# Altium schematic sheet fpga32-serdes-power.SchDoc
size Tabloid; SheetNumber: 55; SheetTotal: 71
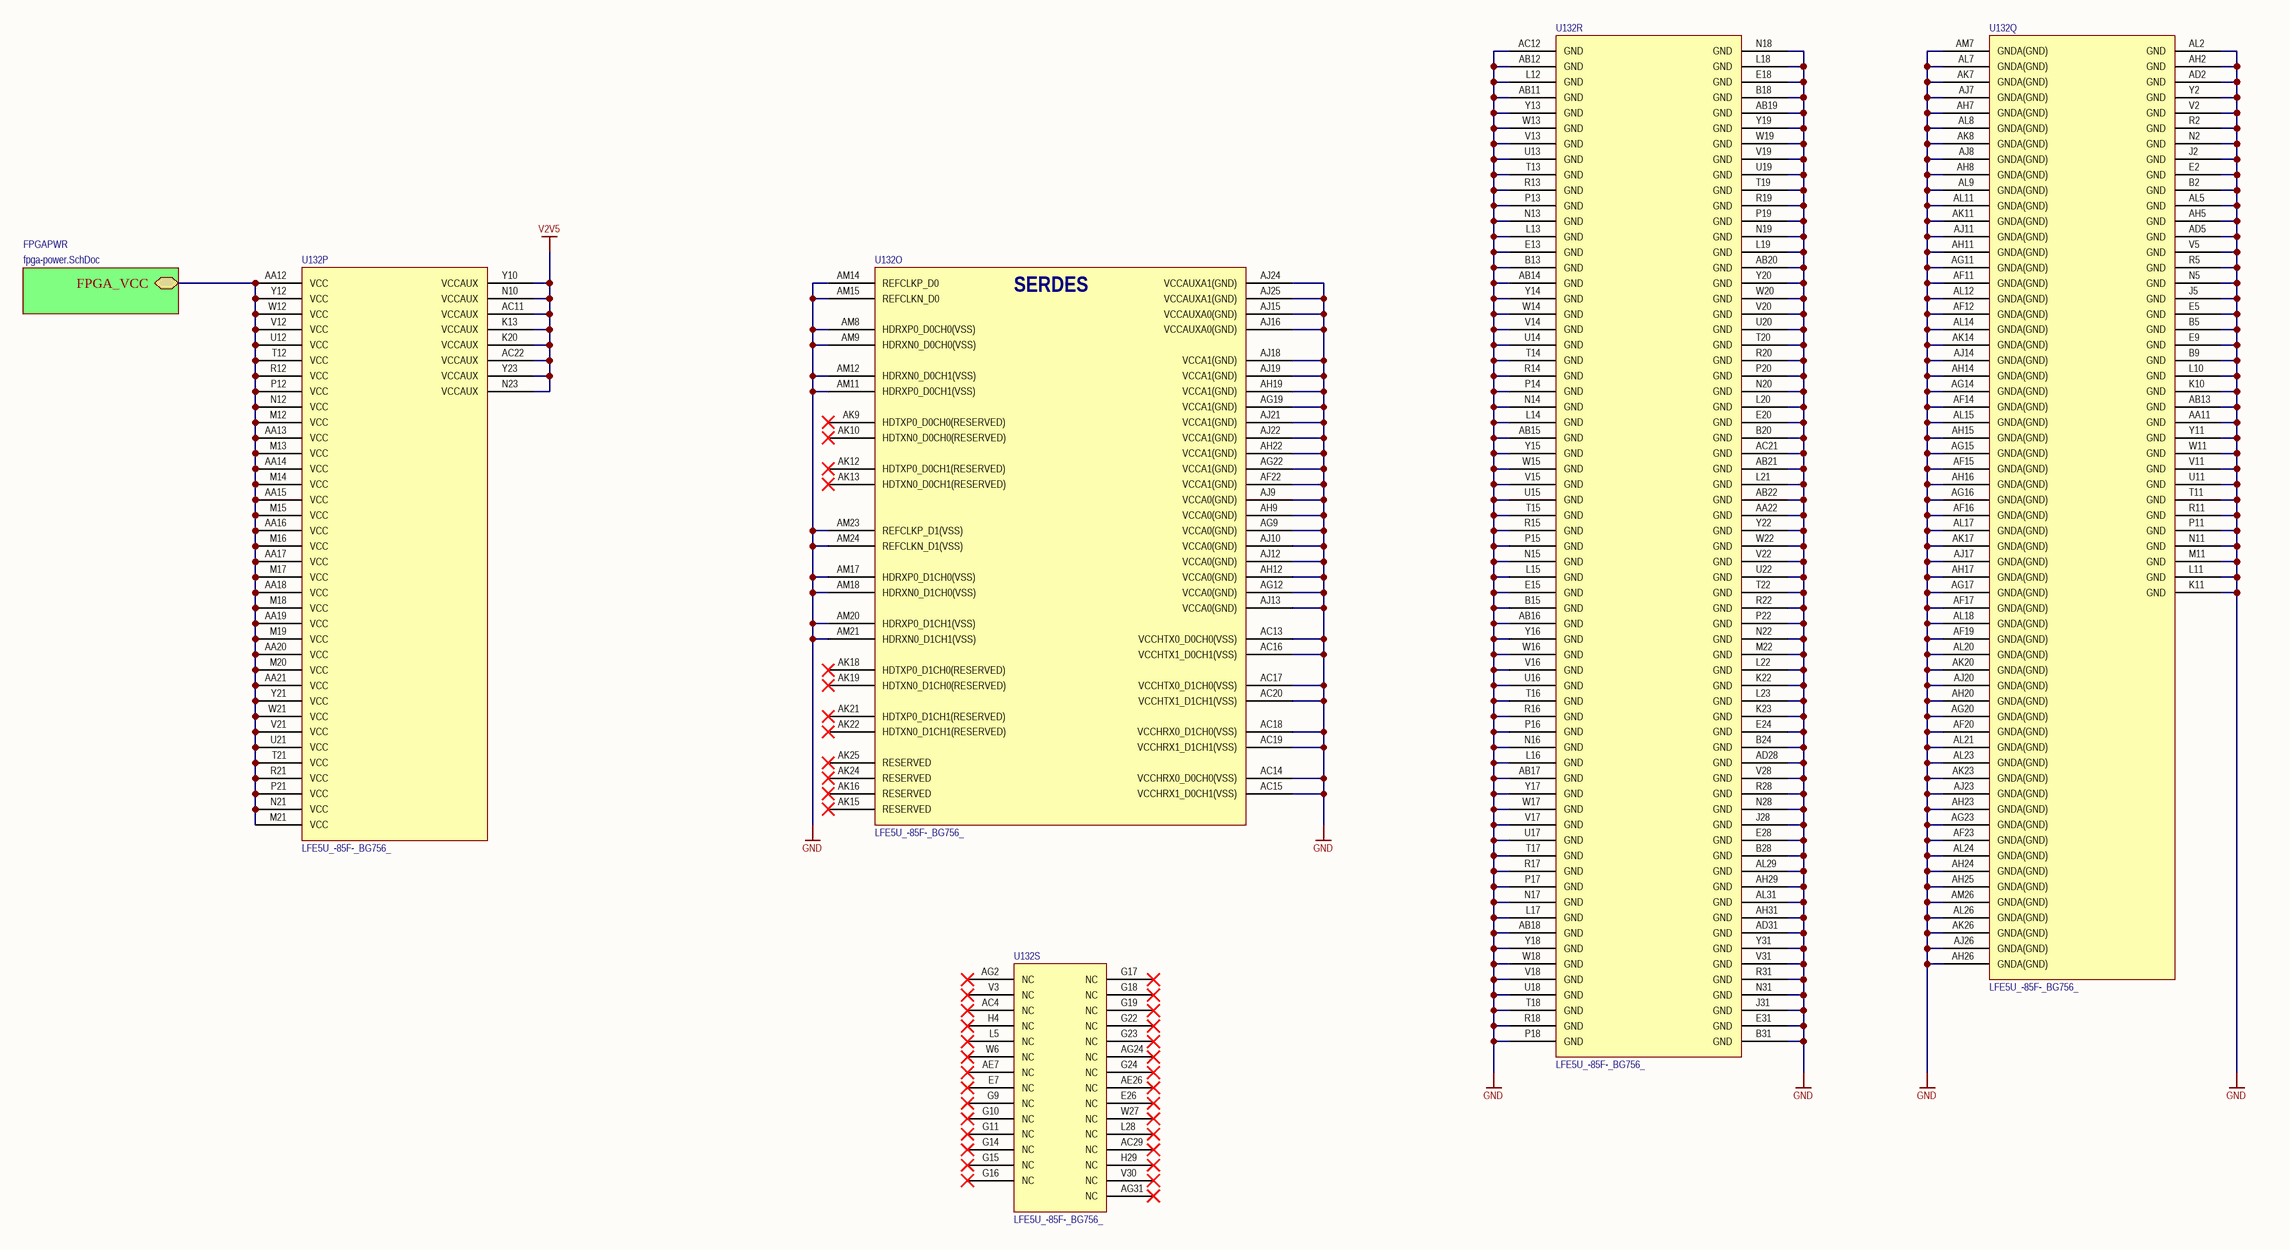
[diagram p0: fpga32-serdes-power.SchDoc]

## Parts
U132  LFE5U_-85F-_BG756_  [caBGA756]  (parts O,P,Q,R,S of 19)

## Sub-sheets
FPGAPWR = fpga-power.SchDoc: FPGA_VCC

## Nets
GND: U132.AA11(GND) U132.AA22(GND) U132.AB11(GND) U132.AB12(GND) U132.AB13(GND) U132.AB14(GND) U132.AB15(GND) U132.AB16(GND) U132.AB17(GND) U132.AB18(GND) U132.AB19(GND) U132.AB20(GND) U132.AB21(GND) U132.AB22(GND) U132.AC12(GND) U132.AC13(VCCHTX0_D0CH0(VSS)) U132.AC14(VCCHRX0_D0CH0(VSS)) U132.AC15(VCCHRX1_D0CH1(VSS)) U132.AC16(VCCHTX1_D0CH1(VSS)) U132.AC17(VCCHTX0_D1CH0(VSS)) U132.AC18(VCCHRX0_D1CH0(VSS)) U132.AC19(VCCHRX1_D1CH1(VSS)) U132.AC20(VCCHTX1_D1CH1(VSS)) U132.AC21(GND) U132.AD2(GND) U132.AD5(GND) U132.AD28(GND) U132.AD31(GND) U132.AF11(GNDA(GND)) U132.AF12(GNDA(GND)) U132.AF14(GNDA(GND)) U132.AF15(GNDA(GND)) U132.AF16(GNDA(GND)) U132.AF17(GNDA(GND)) U132.AF19(GNDA(GND)) U132.AF20(GNDA(GND)) U132.AF22(VCCA1(GND)) U132.AF23(GNDA(GND)) U132.AG9(VCCA0(GND)) U132.AG11(GNDA(GND)) U132.AG12(VCCA0(GND)) U132.AG14(GNDA(GND)) U132.AG15(GNDA(GND)) U132.AG16(GNDA(GND)) U132.AG17(GNDA(GND)) U132.AG19(VCCA1(GND)) U132.AG20(GNDA(GND)) U132.AG22(VCCA1(GND)) U132.AG23(GNDA(GND)) U132.AH2(GND) U132.AH5(GND) U132.AH7(GNDA(GND)) U132.AH8(GNDA(GND)) U132.AH9(VCCA0(GND)) U132.AH11(GNDA(GND)) U132.AH12(VCCA0(GND)) U132.AH14(GNDA(GND)) U132.AH15(GNDA(GND)) U132.AH16(GNDA(GND)) U132.AH17(GNDA(GND)) U132.AH19(VCCA1(GND)) U132.AH20(GNDA(GND)) U132.AH22(VCCA1(GND)) U132.AH23(GNDA(GND)) U132.AH24(GNDA(GND)) U132.AH25(GNDA(GND)) U132.AH26(GNDA(GND)) U132.AH29(GND) U132.AH31(GND) U132.AJ7(GNDA(GND)) U132.AJ8(GNDA(GND)) U132.AJ9(VCCA0(GND)) U132.AJ10(VCCA0(GND)) U132.AJ11(GNDA(GND)) U132.AJ12(VCCA0(GND)) U132.AJ13(VCCA0(GND)) U132.AJ14(GNDA(GND)) U132.AJ15(VCCAUXA0(GND)) U132.AJ16(VCCAUXA0(GND)) U132.AJ17(GNDA(GND)) U132.AJ18(VCCA1(GND)) U132.AJ19(VCCA1(GND)) U132.AJ20(GNDA(GND)) U132.AJ21(VCCA1(GND)) U132.AJ22(VCCA1(GND)) U132.AJ23(GNDA(GND)) U132.AJ24(VCCAUXA1(GND)) U132.AJ25(VCCAUXA1(GND)) U132.AJ26(GNDA(GND)) U132.AK7(GNDA(GND)) U132.AK8(GNDA(GND)) U132.AK11(GNDA(GND)) U132.AK14(GNDA(GND)) U132.AK17(GNDA(GND)) U132.AK20(GNDA(GND)) U132.AK23(GNDA(GND)) U132.AK26(GNDA(GND)) U132.AL2(GND) U132.AL5(GND) U132.AL7(GNDA(GND)) U132.AL8(GNDA(GND)) U132.AL9(GNDA(GND)) U132.AL11(GNDA(GND)) U132.AL12(GNDA(GND)) U132.AL14(GNDA(GND)) U132.AL15(GNDA(GND)) U132.AL17(GNDA(GND)) U132.AL18(GNDA(GND)) U132.AL20(GNDA(GND)) U132.AL21(GNDA(GND)) U132.AL23(GNDA(GND)) U132.AL24(GNDA(GND)) U132.AL26(GNDA(GND)) U132.AL29(GND) U132.AL31(GND) U132.AM7(GNDA(GND)) U132.AM8(HDRXP0_D0CH0(VSS)) U132.AM9(HDRXN0_D0CH0(VSS)) U132.AM11(HDRXP0_D0CH1(VSS)) U132.AM12(HDRXN0_D0CH1(VSS)) U132.AM14(REFCLKP_D0) U132.AM15(REFCLKN_D0) U132.AM17(HDRXP0_D1CH0(VSS)) U132.AM18(HDRXN0_D1CH0(VSS)) U132.AM20(HDRXP0_D1CH1(VSS)) U132.AM21(HDRXN0_D1CH1(VSS)) U132.AM23(REFCLKP_D1(VSS)) U132.AM24(REFCLKN_D1(VSS)) U132.AM26(GNDA(GND)) U132.B2(GND) U132.B5(GND) U132.B9(GND) U132.B13(GND) U132.B15(GND) U132.B18(GND) U132.B20(GND) U132.B24(GND) U132.B28(GND) U132.B31(GND) U132.E2(GND) U132.E5(GND) U132.E9(GND) U132.E13(GND) U132.E15(GND) U132.E18(GND) U132.E20(GND) U132.E24(GND) U132.E28(GND) U132.E31(GND) U132.J2(GND) U132.J5(GND) U132.J28(GND) U132.J31(GND) U132.K10(GND) U132.K11(GND) U132.K22(GND) U132.K23(GND) U132.L10(GND) U132.L11(GND) U132.L12(GND) U132.L13(GND) U132.L14(GND) U132.L15(GND) U132.L16(GND) U132.L17(GND) U132.L18(GND) U132.L19(GND) U132.L20(GND) U132.L21(GND) U132.L22(GND) U132.L23(GND) U132.M11(GND) U132.M22(GND) U132.N2(GND) U132.N5(GND) U132.N11(GND) U132.N13(GND) U132.N14(GND) U132.N15(GND) U132.N16(GND) U132.N17(GND) U132.N18(GND) U132.N19(GND) U132.N20(GND) U132.N22(GND) U132.N28(GND) U132.N31(GND) U132.P11(GND) U132.P13(GND) U132.P14(GND) U132.P15(GND) U132.P16(GND) U132.P17(GND) U132.P18(GND) U132.P19(GND) U132.P20(GND) U132.P22(GND) U132.R2(GND) U132.R5(GND) U132.R11(GND) U132.R13(GND) U132.R14(GND) U132.R15(GND) U132.R16(GND) U132.R17(GND) U132.R18(GND) U132.R19(GND) U132.R20(GND) U132.R22(GND) U132.R28(GND) U132.R31(GND) U132.T11(GND) U132.T13(GND) U132.T14(GND) U132.T15(GND) U132.T16(GND) U132.T17(GND) U132.T18(GND) U132.T19(GND) U132.T20(GND) U132.T22(GND) U132.U11(GND) U132.U13(GND) U132.U14(GND) U132.U15(GND) U132.U16(GND) U132.U17(GND) U132.U18(GND) U132.U19(GND) U132.U20(GND) U132.U22(GND) U132.V2(GND) U132.V5(GND) U132.V11(GND) U132.V13(GND) U132.V14(GND) U132.V15(GND) U132.V16(GND) U132.V17(GND) U132.V18(GND) U132.V19(GND) U132.V20(GND) U132.V22(GND) U132.V28(GND) U132.V31(GND) U132.W11(GND) U132.W13(GND) U132.W14(GND) U132.W15(GND) U132.W16(GND) U132.W17(GND) U132.W18(GND) U132.W19(GND) U132.W20(GND) U132.W22(GND) U132.Y2(GND) U132.Y11(GND) U132.Y13(GND) U132.Y14(GND) U132.Y15(GND) U132.Y16(GND) U132.Y17(GND) U132.Y18(GND) U132.Y19(GND) U132.Y20(GND) U132.Y22(GND) U132.Y31(GND)
V2V5: U132.AC11(VCCAUX) U132.AC22(VCCAUX) U132.K13(VCCAUX) U132.K20(VCCAUX) U132.N10(VCCAUX) U132.N23(VCCAUX) U132.Y10(VCCAUX) U132.Y23(VCCAUX)
NetU132_AA12: U132.AA12(VCC) U132.AA13(VCC) U132.AA14(VCC) U132.AA15(VCC) U132.AA16(VCC) U132.AA17(VCC) U132.AA18(VCC) U132.AA19(VCC) U132.AA20(VCC) U132.AA21(VCC) U132.M12(VCC) U132.M13(VCC) U132.M14(VCC) U132.M15(VCC) U132.M16(VCC) U132.M17(VCC) U132.M18(VCC) U132.M19(VCC) U132.M20(VCC) U132.M21(VCC) U132.N12(VCC) U132.N21(VCC) U132.P12(VCC) U132.P21(VCC) U132.R12(VCC) U132.R21(VCC) U132.T12(VCC) U132.T21(VCC) U132.U12(VCC) U132.U21(VCC) U132.V12(VCC) U132.V21(VCC) U132.W12(VCC) U132.W21(VCC) U132.Y12(VCC) U132.Y21(VCC) ; sheet FPGAPWR/FPGA_VCC

Not connected (* = marked no-connect by the designer): U132 AC4(NC)* AC29(NC)* AE7(NC)* AE26(NC)* AG2(NC)* AG24(NC)* AG31(NC)* AK9(HDTXP0_D0CH0(RESERVED))* AK10(HDTXN0_D0CH0(RESERVED))* AK12(HDTXP0_D0CH1(RESERVED))* AK13(HDTXN0_D0CH1(RESERVED))* AK15(RESERVED)* AK16(RESERVED)* AK18(HDTXP0_D1CH0(RESERVED))* AK19(HDTXN0_D1CH0(RESERVED))* AK21(HDTXP0_D1CH1(RESERVED))* AK22(HDTXN0_D1CH1(RESERVED))* AK24(RESERVED)* AK25(RESERVED)* E7(NC)* E26(NC)* G9(NC)* G10(NC)* G11(NC)* G14(NC)* G15(NC)* G16(NC)* G17(NC)* G18(NC)* G19(NC)* G22(NC)* G23(NC)* G24(NC)* H4(NC)* H29(NC)* L5(NC)* L28(NC)* V3(NC)* V30(NC)* W6(NC)* W27(NC)*

## Notes on the sheet
- (in symbol LFE5U_-85F-_BG756_, part O) SERDES

## Library data of the parts
U132 = LFE5U_-85F-_BG756_: ECP5 FPGA, 85k LUT, 756-caBGA; Manufacturer: Lattice Semiconductor; Manufacturer P/N: LFE5U_-85F-_BG756_